# EAGLE schematic LED_WITH_8051 (EAGLE 9.6.2)
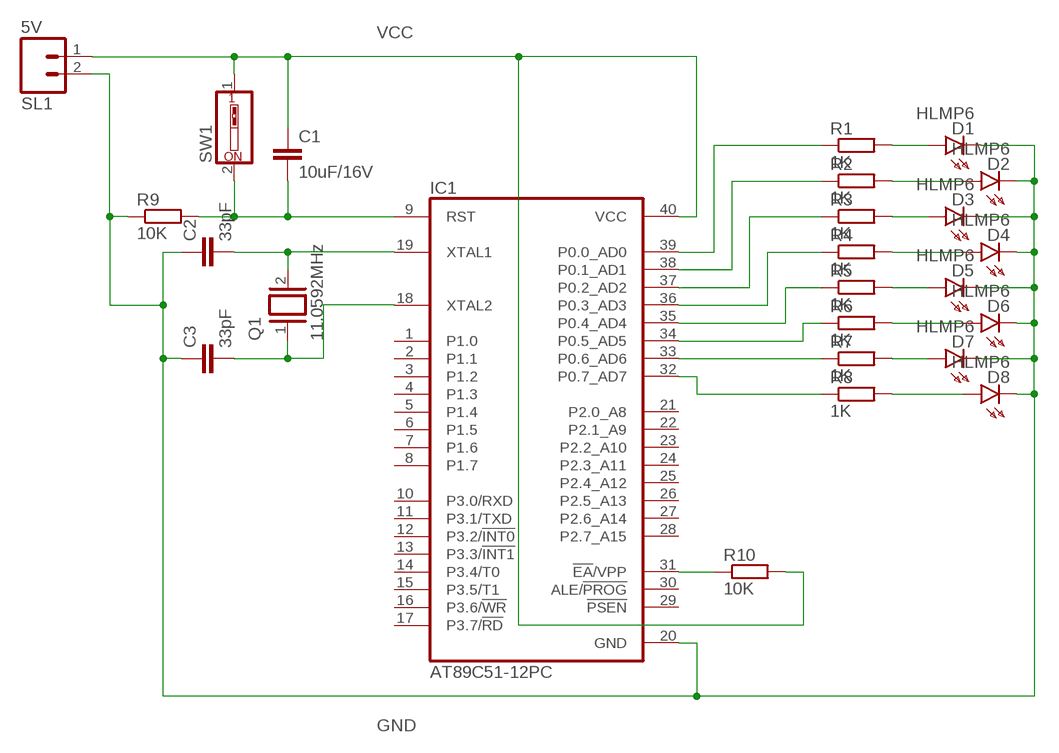
[diagram p0: schematic, sheet 1]

## Parts
C1  10uF/16V  C-EU025-025X050  [C025-025X050]
C2  33pF  C-EU025-025X050  [C025-025X050]
C3  33pF  C-EU025-025X050  [C025-025X050]
D1  HLMP6  [HLMP6]
D2  HLMP6  [HLMP6]
D3  HLMP6  [HLMP6]
D4  HLMP6  [HLMP6]
D5  HLMP6  [HLMP6]
D6  HLMP6  [HLMP6]
D7  HLMP6  [HLMP6]
D8  HLMP6  [HLMP6]
IC1  AT89C51-12PC  [DIL40]
Q1  11.0592MHz  XTAL  [Q]
R1  1K  R-EU_0204/7  [0204/7]
R2  1K  R-EU_0204/7  [0204/7]
R3  1K  R-EU_0204/7  [0204/7]
R4  1K  R-EU_0204/7  [0204/7]
R5  1K  R-EU_0204/7  [0204/7]
R6  1K  R-EU_0204/7  [0204/7]
R7  1K  R-EU_0204/7  [0204/7]
R8  1K  R-EU_0204/7  [0204/7]
R9  10K  R-EU_0204/7  [0204/7]
R10  10K  R-EU_0204/7  [0204/7]
SL1  5V  M02  [02P]
SW1  SW_DIP-1  [EDG-01]

## Nets
GND: C2.1 C3.1 D1.K D2.K D3.K D4.K D5.K D6.K D7.K D8.K IC1.20(GND) R9.1 SL1.2
N$1: C2.2 IC1.19(XTAL1) Q1.2
N$2: C3.2 IC1.18(XTAL2) Q1.1
N$3: IC1.36(P0.3_AD3) R4.1
N$4: C1.2 IC1.9(RST) R9.2 SW1.2
N$5: D1.A R1.2
N$6: D2.A R2.2
N$7: D3.A R3.2
N$8: D4.A R4.2
N$9: D5.A R5.2
N$10: D6.A R6.2
N$11: D7.A R7.2
N$12: D8.A R8.2
N$13: IC1.39(P0.0_AD0) R1.1
N$14: IC1.38(P0.1_AD1) R2.1
N$15: IC1.32(P0.7_AD7) R8.1
N$16: IC1.33(P0.6_AD6) R7.1
N$17: IC1.37(P0.2_AD2) R3.1
N$18: IC1.35(P0.4_AD4) R5.1
N$19: IC1.34(P0.5_AD5) R6.1
N$22: IC1.31(!EA!/VPP) R10.1
VCC: C1.1 IC1.40(VCC) R10.2 SL1.1 SW1.1
Unconnected: IC1.1(P1.0) IC1.2(P1.1) IC1.3(P1.2) IC1.4(P1.3) IC1.5(P1.4) IC1.6(P1.5) IC1.7(P1.6) IC1.8(P1.7) IC1.10(P3.0/RXD) IC1.11(P3.1/TXD) IC1.12(P3.2/!INT0) IC1.13(P3.3/!INT1) IC1.14(P3.4/T0) IC1.15(P3.5/T1) IC1.16(P3.6/!WR) IC1.17(P3.7/!RD) IC1.21(P2.0_A8) IC1.22(P2.1_A9) IC1.23(P2.2_A10) IC1.24(P2.3_A11) IC1.25(P2.4_A12) IC1.26(P2.5_A13) IC1.27(P2.6_A14) IC1.28(P2.7_A15) IC1.29(!PSEN) IC1.30(ALE/!PROG)

## Library data of the parts
C1-C3 = rcl:C-EU: CAPACITOR, European symbol; SPICEPREFIX: C
D1-D8 = display-hp:HLMP6: LED 2mm horizontal; MF: AGILENT TECHNOLOGIES; MPN: HLMP-6500; OC_FARNELL: 1652490; OC_NEWARK: 40K0088
IC1 = atmel:AT89C51-*: 8-bit Microcontroller with 4K Bytes Flash Not Recommended for New Designs. Use AT89S51. Source: http://www.atmel.com/dyn/resources/prod_documents/doc0265.; OC_FARNELL: unknown; OC_NEWARK: unknown
Q1 = special:XTAL: CRYSTAL
R1-R10 = rcl:R-EU_: RESISTOR, European symbol; SPICEPREFIX: R
SL1 = con-amp-quick:M02: AMP QUICK CONNECTOR; OC_FARNELL: unknown; OC_NEWARK: unknown
SW1 = special:SW_DIP-1: DIP SWITCH